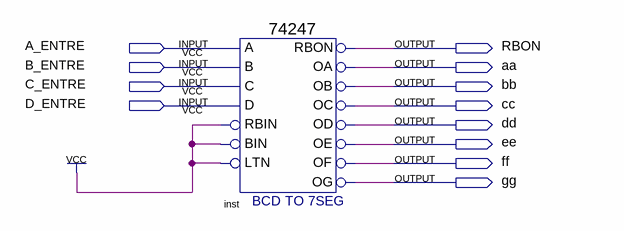
[diagram p0: schematic sheet]
// Quartus schematic blocoDecoder7segmentos.bdf as structural Verilog: 1 symbols, 12 pins
module blocoDecoder7segmentos (
  input  A_ENTRE,
  input  B_ENTRE,
  input  C_ENTRE,
  input  D_ENTRE,
  output RBON,
  output aa,
  output bb,
  output cc,
  output dd,
  output ee,
  output ff,
  output gg
);

  \74247  inst (
    .LTN(1'b1), .BIN(1'b1), .A(A_ENTRE), .B(B_ENTRE), .RBIN(1'b1), .C(C_ENTRE), .D(D_ENTRE), .OF(ff),
    .OC(cc), .OD(dd), .OE(ee), .RBON(RBON), .OA(aa), .OB(bb), .OG(gg));
endmodule
